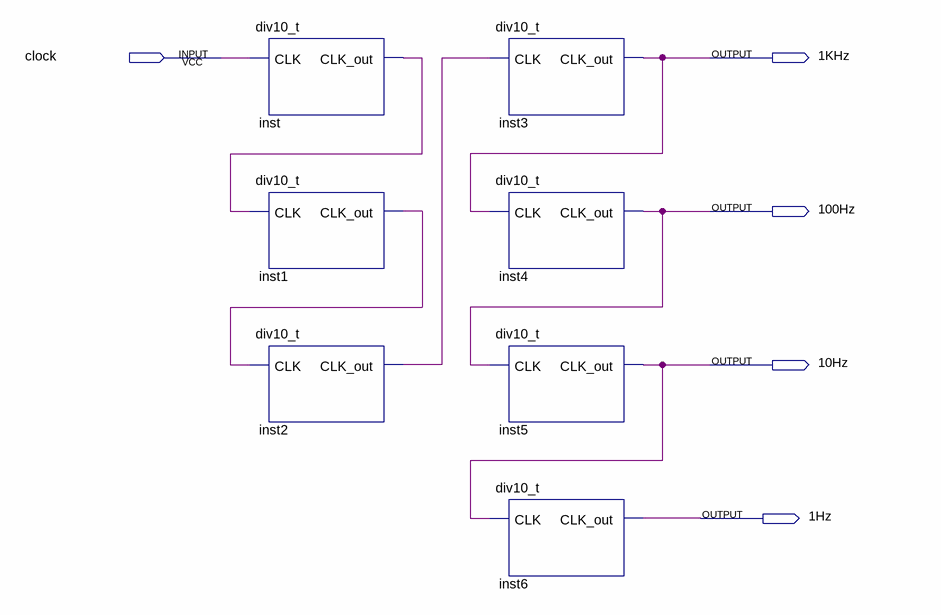
[diagram p0: schematic sheet]
// Quartus schematic clk_gen.bdf as structural Verilog: 7 symbols, 5 pins
module clk_gen (
  input  clock,
  output \1KHz ,
  output \100Hz ,
  output \10Hz ,
  output \1Hz 
);

  wire inst1_clk_out, inst2_clk_out, inst_clk_out;

  div10_t inst (.CLK(clock), .CLK_out(inst_clk_out));
  div10_t inst1 (.CLK(inst_clk_out), .CLK_out(inst1_clk_out));
  div10_t inst2 (.CLK(inst1_clk_out), .CLK_out(inst2_clk_out));
  div10_t inst3 (.CLK(inst2_clk_out), .CLK_out(\1KHz ));
  div10_t inst4 (.CLK(\1KHz ), .CLK_out(\100Hz ));
  div10_t inst5 (.CLK(\100Hz ), .CLK_out(\10Hz ));
  div10_t inst6 (.CLK(\10Hz ), .CLK_out(\1Hz ));
endmodule
